# Altium project CandoM.PrjPcb
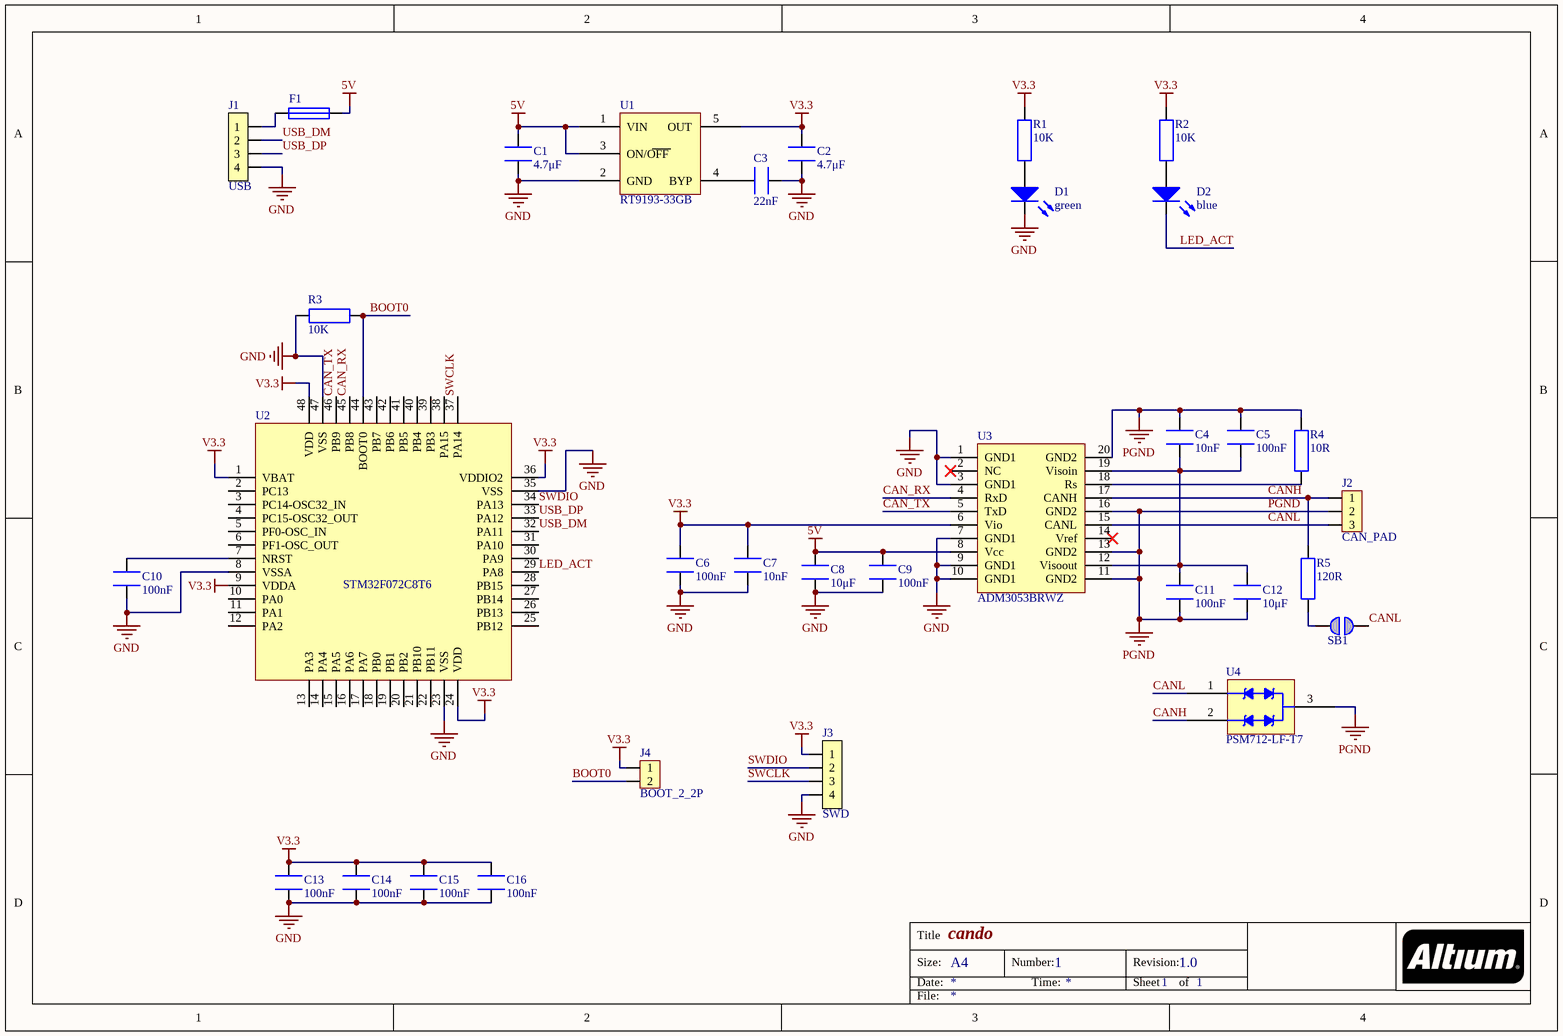
[diagram p0: CandoM.SchDoc]
1 sheet, 33 parts. Net scope: global (net labels, ports and power ports of the same name join across sheets).
Board file: CandoM.PcbDoc

## Sheet CandoM.SchDoc: cando
size A4; DocumentNumber: 1; Revision: 1.0; SheetNumber: 1; SheetTotal: 1; DrawnBy: SU; DocumentSize: A4; PCAName: cando

### Parts
C1  4.7μF  [CAP_0603]
C2  4.7μF  [CAP_0603]
C3  22nF  [CAP_0603]
C4  10nF  [CAP_0603]
C5  100nF  [CAP_0603]
C6  100nF  [CAP_0603]
C7  10nF  [CAP_0603]
C8  10μF  [CAP_0805]
C9  100nF  [CAP_0603]
C10  100nF  [CAP_0603]
C11  100nF  [CAP_0603]
C12  10μF  [CAP_0805]
C13  100nF  [CAP_0603]
C14  100nF  [CAP_0603]
C15  100nF  [CAP_0603]
C16  100nF  [CAP_0603]
D1  green  [LED_GREEN_0603]
D2  blue  [LED_BLUE_0603]
F1  PTC_0805  [RES_0805]  (value not drawn)
J1  USB  [USB_PAD]  (no BOM)
J2  CAN_PAD  [CAN_PAD]  (no BOM)
J3  SWD  [SWD-2.54-4P]  (no BOM)
J4  BOOT_2_2P  [BOOT_2_2P]  (no BOM)
R1  10K  [RES_0603]
R2  10K  [RES_0603]
R3  10K  [RES_0603]
R4  10R  [RES_0603]
R5  120R  [RES_0603]
SB1  Solderbridge  [Solderbridge]  (value not drawn)  (no BOM)
U1  RT9193-33GB  [SOT23-5]
U2  STM32F072C8T6  [STM-LQFP48_N]
U3  ADM3053BRWZ  [SOIC-20]
U4  PSM712-LF-T7  [SOT-23(SOT-23-3)]

### Nets
5V: C1.2 C8.2 C9.2 F1.2 U1.1(VIN) U1.3(ON/OFF) U3.8(Vcc)
GND: C1.1 C2.1 C3.1 C6.1 C7.1 C8.1 C9.1 C10.1 C13.1 C14.1 C15.1 C16.1 D1.K J1.0 J1.4 J3.0 J3.4 R3.2 U1.2(GND) U2.8(VSSA) U2.23(VSS) U2.35(VSS) U2.47(VSS) U3.1(GND1) U3.3(GND1) U3.7(GND1) U3.9(GND1) U3.10(GND1)
PGND: C4.2 C5.2 C11.1 C12.1 J2.2 R4.2 U3.11(GND2) U3.13(GND2) U3.16(GND2) U3.20(GND2) U4.3
V3.3: C2.2 C6.2 C7.2 C13.2 C14.2 C15.2 C16.2 J3.1 J4.1 R1.2 R2.2 U1.5(OUT) U2.1(VBAT) U2.9(VDDA) U2.24(VDD) U2.36(VDDIO2) U2.48(VDD) U3.6(Vio)
BOOT0: J4.2 R3.1 U2.44(BOOT0)
CAN_RX: U2.45(PB8) U3.4(RxD)
CAN_TX: U2.46(PB9) U3.5(TxD)
CANH: J2.1 R5.1 U3.17(CANH) U4.2
CANL: J2.3 SB1.2 U3.15(CANL) U4.1
LED_ACT: D2.K U2.29(PA8)
SWCLK: J3.3 U2.37(PA14)
SWDIO: J3.2 U2.34(PA13)
USB_DM: J1.2 U2.32(PA11)
USB_DP: J1.3 U2.33(PA12)
NetC3_2: C3.2 U1.4(BYP)
NetC4_1: C4.1 C5.1 C11.2 C12.2 U3.12(Visoout) U3.19(Visoin)
NetC10_2: C10.2 U2.7(NRST)
NetD1_A: D1.A R1.1
NetD2_A: D2.A R2.1
NetF1_1: F1.1 J1.1
NetR4_1: R4.1 U3.18(Rs)
NetR5_2: R5.2 SB1.1

Not connected (* = marked no-connect by the designer): U2 2(PC13) 3(PC14-OSC32_IN) 4(PC15-OSC32_OUT) 5(PF0-OSC_IN) 6(PF1-OSC_OUT) 10(PA0) 11(PA1) 12(PA2) 13(PA3) 14(PA4) 15(PA5) 16(PA6) 17(PA7) 18(PB0) 19(PB1) 20(PB2) 21(PB10) 22(PB11) 25(PB12) 26(PB13) 27(PB14) 28(PB15) 30(PA9) 31(PA10) 38(PA15) 39(PB3) 40(PB4) 41(PB5) 42(PB6) 43(PB7); U3 2(NC)* 14(Vref)*

### Notes on the sheet
- Title
- Size:
- Date:
- A4
- Number:
- Time:
- Revision:
- Sheet
- of
- File:

### Library data of the parts
C1 C2 = CAP_4.7μF_0603: Cap 4.7μF 6.3V X5R 0603
C3 = CAP_22nF_0603: Cap 22nF 50V X5R 0603
C4 C7 = CAP_10nF_0603: Cap 10nF 50V X5R 0603
C5 C6 C9-C11 C13-C16 = CAP_100nF_0603: Cap 100nF 50V X5R 0603
C8 C12 = CAP_10μF_0805: Cap 10μF 25V X5R 0805
D1 = LED_GREEN_0603: LED green 0603
D2 = LED_BLUE_0603: LED blue 0603
F1 = PTC_0805: PTC 0.5A 0805 C20978
J1 = USB_PAD
J3 = SWD_2.54_4P: SWD 2.54 4P
R1-R3 = RES_10K_0603: Res SMD 10K 5% 1/10W 0603
R4 = RES_10R_0603: Res SMD 10R 1% 1/10W 0603
R5 = RES_120R_0603: Res SMD 120R 1% 1/10W 0603
U1 = RT9193-33GB: Chip RT9193-33GB LDO Regulator C15651
U2 = STM32F072C8T6: Chip STM32F072C8T6 C80488
U3 = ADM3053BRWZ: Chip ADM3053BRWZ
U4 = PSM712-LF-T7: TVS; ComponentLink1Description: 供应商链接; ComponentLink1URL: http://www.szlcsc.com/product/details_33642.html; Package: SOT-23(SOT-23-3); Supplier: LC; SuppliersPartNumber: C32677
SB1 = SOLDERBRIDGE: Value: Solderbridge